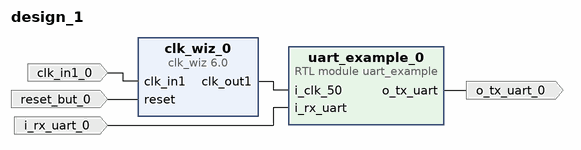
[diagram p0: block diagram of the top level]
# Vivado block design design_1, xc7a35ticsg324-1L, Vivado 2021.2
create_bd_design design_1

create_bd_port -dir I i_rx_uart_0
create_bd_port -dir O o_tx_uart_0
create_bd_port -dir I -type clk clk_in1_0
create_bd_port -dir I -type rst reset_but_0
set_property -dict {CONFIG.POLARITY ACTIVE_HIGH} [get_bd_ports reset_but_0]

create_bd_cell -type ip -vlnv xilinx.com:ip:clk_wiz:6.0 clk_wiz_0
set_property -dict [list \
  CONFIG.CLKOUT1_JITTER 151.636 \
  CONFIG.CLKOUT1_REQUESTED_OUT_FREQ 50.000 \
  CONFIG.CLK_IN1_BOARD_INTERFACE Custom \
  CONFIG.MMCM_CLKOUT0_DIVIDE_F 20.000 \
] [get_bd_cells clk_wiz_0]
create_bd_cell -type module -reference uart_example uart_example_0

# ---- connections ----

connect_bd_net -net clk_in1_0_1 [get_bd_ports clk_in1_0] [get_bd_pins clk_wiz_0/clk_in1]
connect_bd_net [get_bd_pins clk_wiz_0/clk_out1] [get_bd_pins uart_example_0/i_clk_50]
connect_bd_net -net i_rx_uart_0_1 [get_bd_ports i_rx_uart_0] [get_bd_pins uart_example_0/i_rx_uart]
connect_bd_net -net reset_0_1 [get_bd_ports reset_but_0] [get_bd_pins clk_wiz_0/reset]
connect_bd_net [get_bd_pins uart_example_0/o_tx_uart] [get_bd_ports o_tx_uart_0]

validate_bd_design
save_bd_design
